# EasyEDA Pro project ProPrj_keyboard_2024-11-03.epro

# Schematic Schematic1
Create Date: 2022-11-01; Page Name: P1; Project Name: 单片机教程-键盘; Schematic Name: Schematic1; Update Date: 2022-11-01; Company: Keep-PCB-safe; Page Size: A2; Version: V1.0
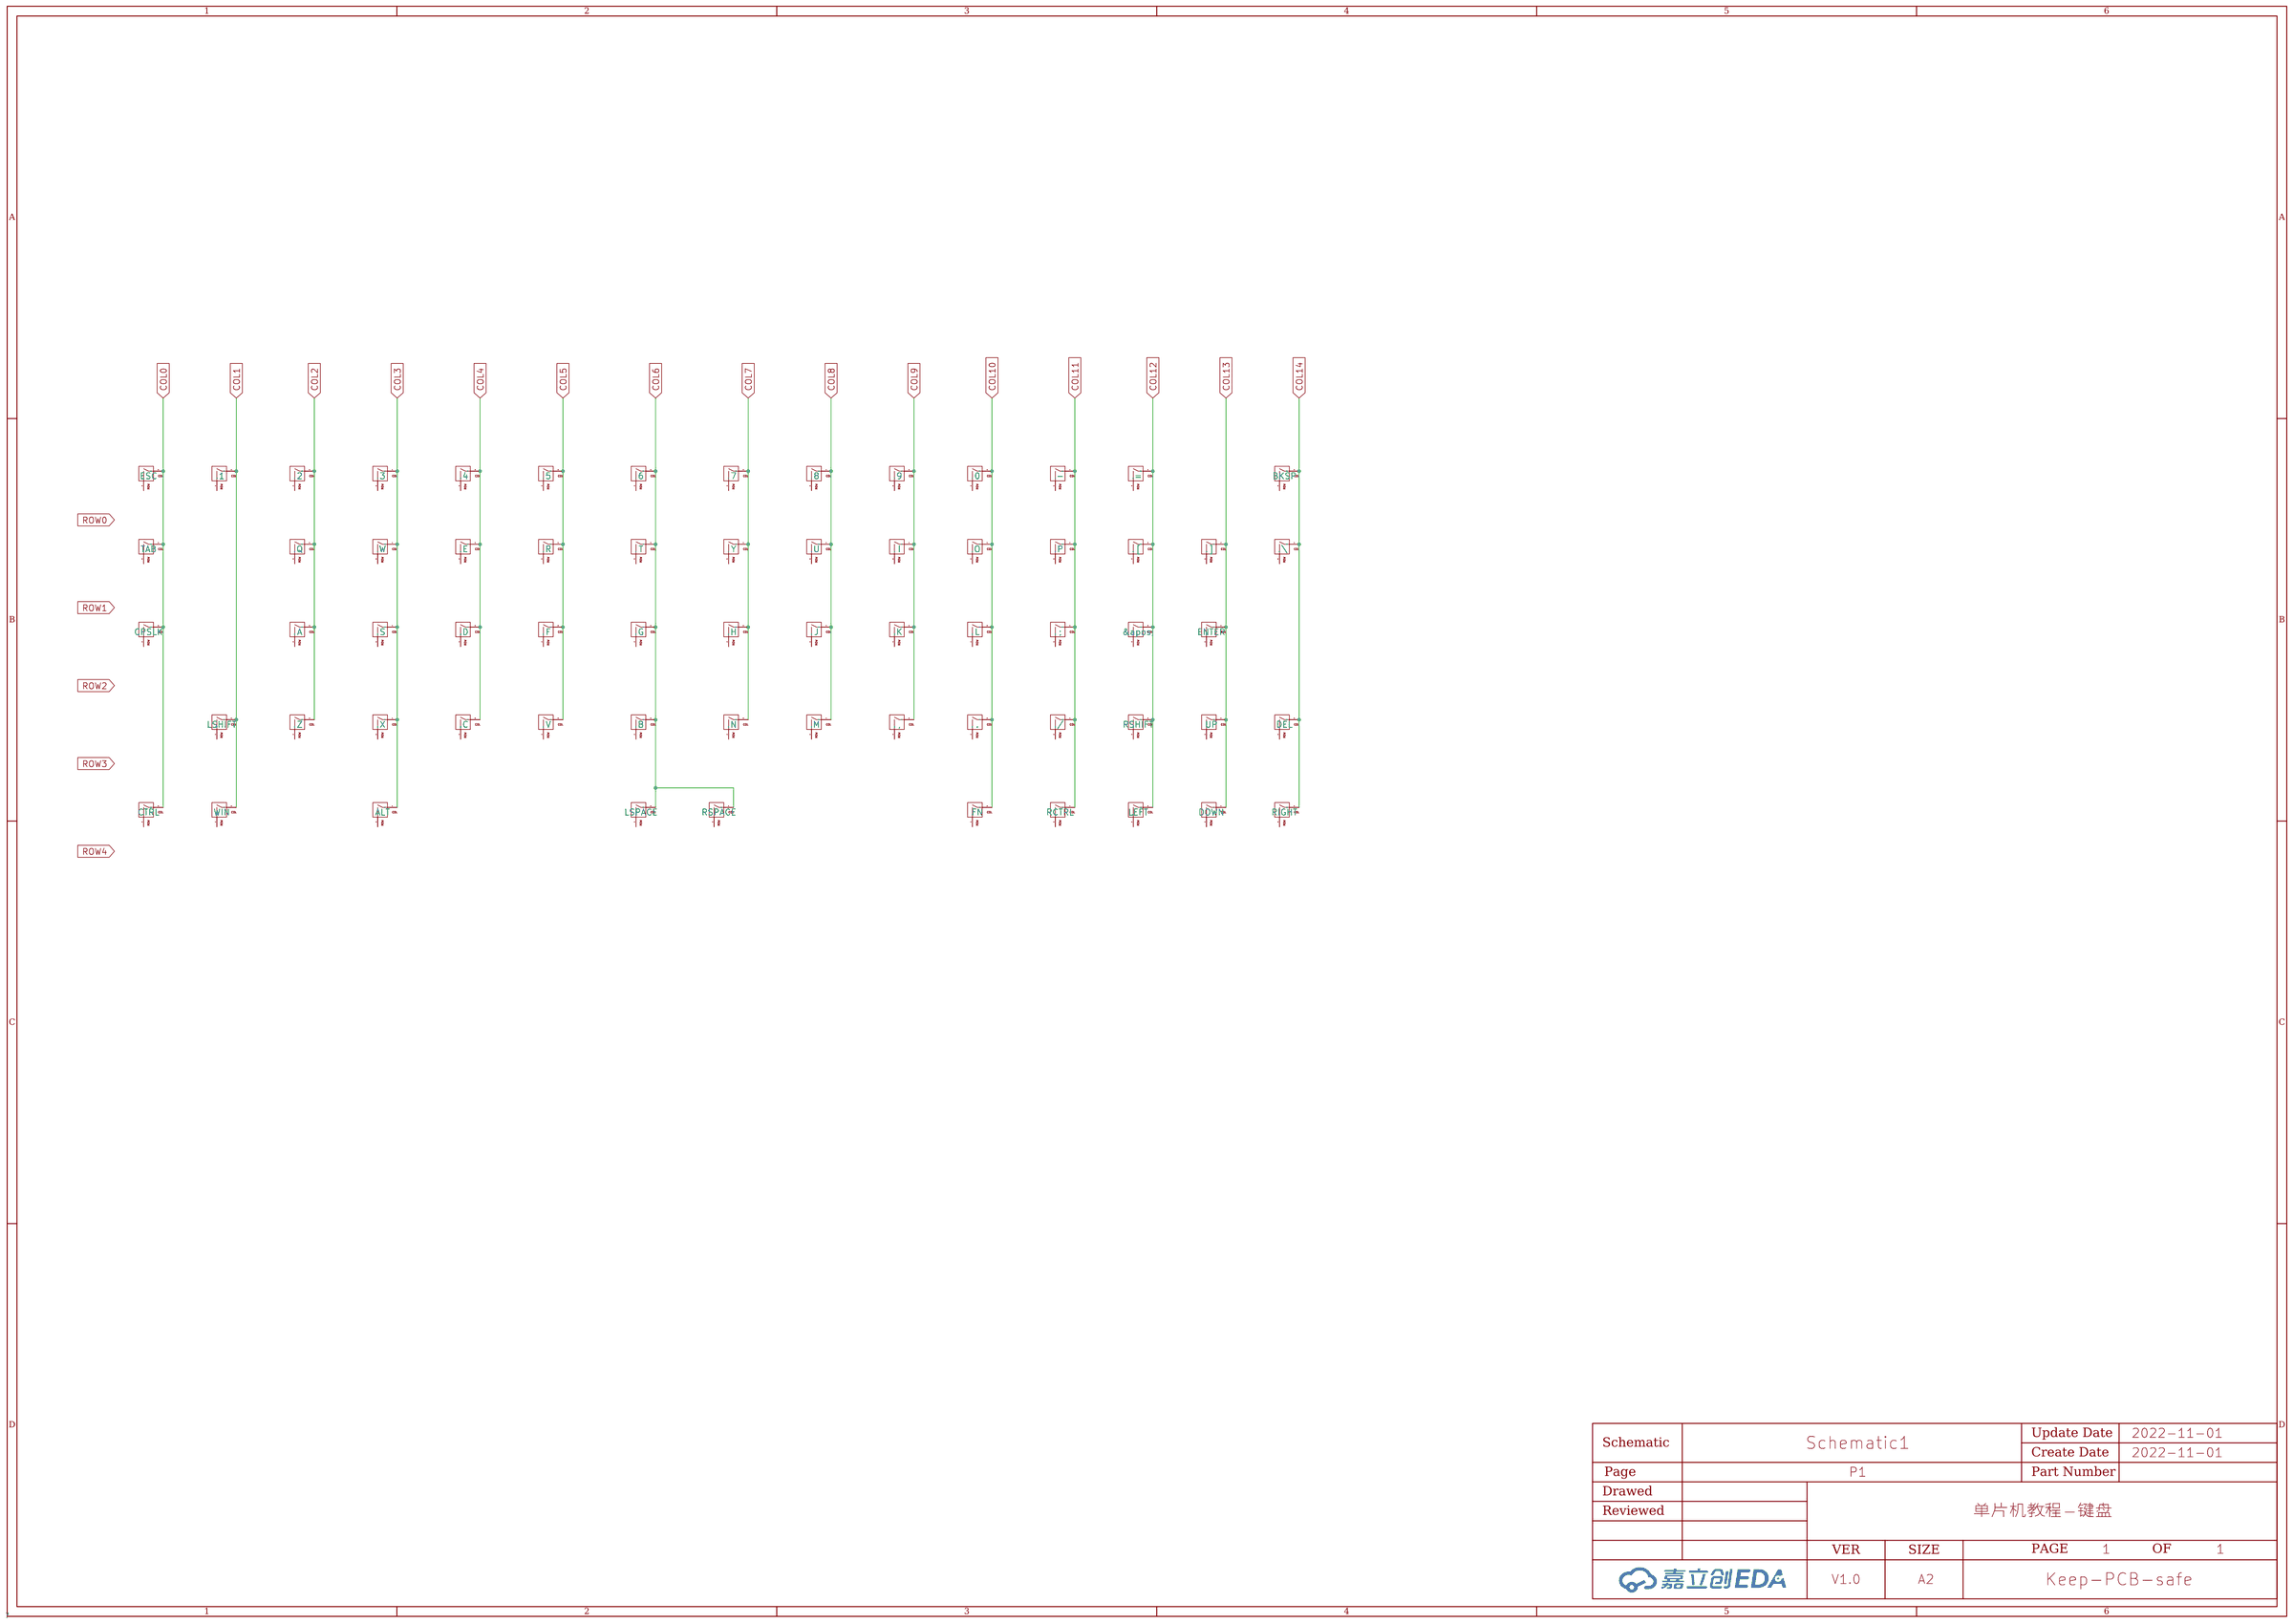
[diagram p0: schematic sheet]

## Parts
0  MX-NoLED  [MX_ALPS_HYBRID:MXONLY-1U]
1  MX-NoLED  [MX_ALPS_HYBRID:MXONLY-1U]
2  MX-NoLED  [MX_ALPS_HYBRID:MXONLY-1U]
3  MX-NoLED  [MX_ALPS_HYBRID:MXONLY-1U]
4  MX-NoLED  [MX_ALPS_HYBRID:MXONLY-1U]
5  MX-NoLED  [MX_ALPS_HYBRID:MXONLY-1U]
6  MX-NoLED  [MX_ALPS_HYBRID:MXONLY-1U]
7  MX-NoLED  [MX_ALPS_HYBRID:MXONLY-1U]
8  MX-NoLED  [MX_ALPS_HYBRID:MXONLY-1U]
9  MX-NoLED  [MX_ALPS_HYBRID:MXONLY-1U]
&apos;  MX-NoLED  [MX_ALPS_HYBRID:MXONLY-1U]
,  MX-NoLED  [MX_ALPS_HYBRID:MXONLY-1U]
-  MX-NoLED  [MX_ALPS_HYBRID:MXONLY-1U]
.  MX-NoLED  [MX_ALPS_HYBRID:MXONLY-1U]
/  MX-NoLED  [MX_ALPS_HYBRID:MXONLY-1U]
;  MX-NoLED  [MX_ALPS_HYBRID:MXONLY-1U]
=  MX-NoLED  [MX_ALPS_HYBRID:MXONLY-1U]
[  MX-NoLED  [MX_ALPS_HYBRID:MXONLY-1U]
\  MX-NoLED  [MX_ALPS_HYBRID:MXONLY-1U]
]  MX-NoLED  [MX_ALPS_HYBRID:MXONLY-1U]
A  MX-NoLED  [MX_ALPS_HYBRID:MXONLY-1U]
ALT  MX-NoLED  [MX_ALPS_HYBRID:MXONLY-1U]
B  MX-NoLED  [MX_ALPS_HYBRID:MXONLY-1U]
BKSP  MX-NoLED  [MX_ALPS_HYBRID:MXONLY-1U]
C  MX-NoLED  [MX_ALPS_HYBRID:MXONLY-1U]
CPSLK  MX-NoLED  [MX_ALPS_HYBRID:MXONLY-1U]
CTRL  MX-NoLED  [MX_ALPS_HYBRID:MXONLY-1U]
D  MX-NoLED  [MX_ALPS_HYBRID:MXONLY-1U]
DEL  MX-NoLED  [MX_ALPS_HYBRID:MXONLY-1U]
DOWN  MX-NoLED  [MX_ALPS_HYBRID:MXONLY-1U]
E  MX-NoLED  [MX_ALPS_HYBRID:MXONLY-1U]
ENTER  MX-NoLED  [MX_ALPS_HYBRID:MXONLY-1U]
ESC  MX-NoLED  [MX_ALPS_HYBRID:MXONLY-1U]
F  MX-NoLED  [MX_ALPS_HYBRID:MXONLY-1U]
FN  MX-NoLED  [MX_ALPS_HYBRID:MXONLY-1U]
G  MX-NoLED  [MX_ALPS_HYBRID:MXONLY-1U]
H  MX-NoLED  [MX_ALPS_HYBRID:MXONLY-1U]
I  MX-NoLED  [MX_ALPS_HYBRID:MXONLY-1U]
J  MX-NoLED  [MX_ALPS_HYBRID:MXONLY-1U]
K  MX-NoLED  [MX_ALPS_HYBRID:MXONLY-1U]
L  MX-NoLED  [MX_ALPS_HYBRID:MXONLY-1U]
LEFT  MX-NoLED  [MX_ALPS_HYBRID:MXONLY-1U]
LSHIFT  MX-NoLED  [MX_ALPS_HYBRID:MXONLY-1U]
LSPACE  MX-NoLED  [MX_ALPS_HYBRID:MXONLY-1U]
M  MX-NoLED  [MX_ALPS_HYBRID:MXONLY-1U]
N  MX-NoLED  [MX_ALPS_HYBRID:MXONLY-1U]
O  MX-NoLED  [MX_ALPS_HYBRID:MXONLY-1U]
P  MX-NoLED  [MX_ALPS_HYBRID:MXONLY-1U]
Q  MX-NoLED  [MX_ALPS_HYBRID:MXONLY-1U]
R  MX-NoLED  [MX_ALPS_HYBRID:MXONLY-1U]
RCTRL  MX-NoLED  [MX_ALPS_HYBRID:MXONLY-1U]
RIGHT  MX-NoLED  [MX_ALPS_HYBRID:MXONLY-1U]
RSHIFT  MX-NoLED  [MX_ALPS_HYBRID:MXONLY-1U]
RSPACE  MX-NoLED  [MX_ALPS_HYBRID:MXONLY-1U]
S  MX-NoLED  [MX_ALPS_HYBRID:MXONLY-1U]
T  MX-NoLED  [MX_ALPS_HYBRID:MXONLY-1U]
TAB  MX-NoLED  [MX_ALPS_HYBRID:MXONLY-1U]
U  MX-NoLED  [MX_ALPS_HYBRID:MXONLY-1U]
UP  MX-NoLED  [MX_ALPS_HYBRID:MXONLY-1U]
V  MX-NoLED  [MX_ALPS_HYBRID:MXONLY-1U]
W  MX-NoLED  [MX_ALPS_HYBRID:MXONLY-1U]
WIN  MX-NoLED  [MX_ALPS_HYBRID:MXONLY-1U]
X  MX-NoLED  [MX_ALPS_HYBRID:MXONLY-1U]
Y  MX-NoLED  [MX_ALPS_HYBRID:MXONLY-1U]
Z  MX-NoLED  [MX_ALPS_HYBRID:MXONLY-1U]

## Library data of the parts
0-9 &apos; , - . / ; = [ \ ] A ALT B BKSP C CPSLK CTRL D DEL DOWN E ENTER ESC F FN G H I J K L LEFT LSHIFT LSPACE M N O P Q R RCTRL RIGHT RSHIFT RSPACE S T TAB U UP V W WIN X Y Z = MX-无LED

## Nets
COL0: CPSLK.1(COL) CTRL.1(COL) ESC.1(COL) TAB.1(COL)
COL1: 1.1(COL) LSHIFT.1(COL) WIN.1(COL)
COL2: 2.1(COL) A.1(COL) Q.1(COL) Z.1(COL)
COL3: 3.1(COL) ALT.1(COL) S.1(COL) W.1(COL) X.1(COL)
COL4: 4.1(COL) C.1(COL) D.1(COL) E.1(COL)
COL5: 5.1(COL) F.1(COL) R.1(COL) V.1(COL)
COL6: 6.1(COL) B.1(COL) G.1(COL) LSPACE.1(COL) RSPACE.1(COL) T.1(COL)
COL7: 7.1(COL) H.1(COL) N.1(COL) Y.1(COL)
COL8: 8.1(COL) J.1(COL) M.1(COL) U.1(COL)
COL9: 9.1(COL) ,.1(COL) I.1(COL) K.1(COL)
COL10: 0.1(COL) ..1(COL) FN.1(COL) L.1(COL) O.1(COL)
COL11: -.1(COL) /.1(COL) ;.1(COL) P.1(COL) RCTRL.1(COL)
COL12: &apos;.1(COL) =.1(COL) [.1(COL) LEFT.1(COL) RSHIFT.1(COL)
COL13: ].1(COL) DOWN.1(COL) ENTER.1(COL) UP.1(COL)
COL14: \.1(COL) BKSP.1(COL) DEL.1(COL) RIGHT.1(COL)

Not connected (* = marked no-connect by the designer): 0 2(ROW); 1 2(ROW); 2 2(ROW); 3 2(ROW); 4 2(ROW); 5 2(ROW); 6 2(ROW); 7 2(ROW); 8 2(ROW); 9 2(ROW); &apos; 2(ROW); , 2(ROW); - 2(ROW); . 2(ROW); / 2(ROW); ; 2(ROW); = 2(ROW); [ 2(ROW); \ 2(ROW); ] 2(ROW); A 2(ROW); ALT 2(ROW); B 2(ROW); BKSP 2(ROW); C 2(ROW); CPSLK 2(ROW); CTRL 2(ROW); D 2(ROW); DEL 2(ROW); DOWN 2(ROW); E 2(ROW); ENTER 2(ROW); ESC 2(ROW); F 2(ROW); FN 2(ROW); G 2(ROW); H 2(ROW); I 2(ROW); J 2(ROW); K 2(ROW); L 2(ROW); LEFT 2(ROW); LSHIFT 2(ROW); LSPACE 2(ROW); M 2(ROW); N 2(ROW); O 2(ROW); P 2(ROW); Q 2(ROW); R 2(ROW); RCTRL 2(ROW); RIGHT 2(ROW); RSHIFT 2(ROW); RSPACE 2(ROW); S 2(ROW); T 2(ROW); TAB 2(ROW); U 2(ROW); UP 2(ROW); V 2(ROW); W 2(ROW); WIN 2(ROW); X 2(ROW); Y 2(ROW); Z 2(ROW)
